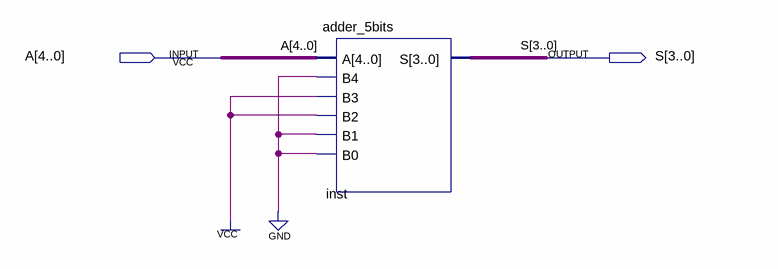
[diagram p0: schematic sheet]
// Quartus schematic subtrator_5bits_10100.bdf as structural Verilog: 1 symbols, 2 pins
module subtrator_5bits_10100 (
  input  [4:0] A,
  output [3:0] S
);

  adder_5bits inst (.A(A), .B4(1'b0), .B3(1'b1), .B2(1'b1), .B1(1'b0), .B0(1'b0), .S(S));
endmodule
